# Altium schematic sheet RelayOutputs.SchDoc
size A4
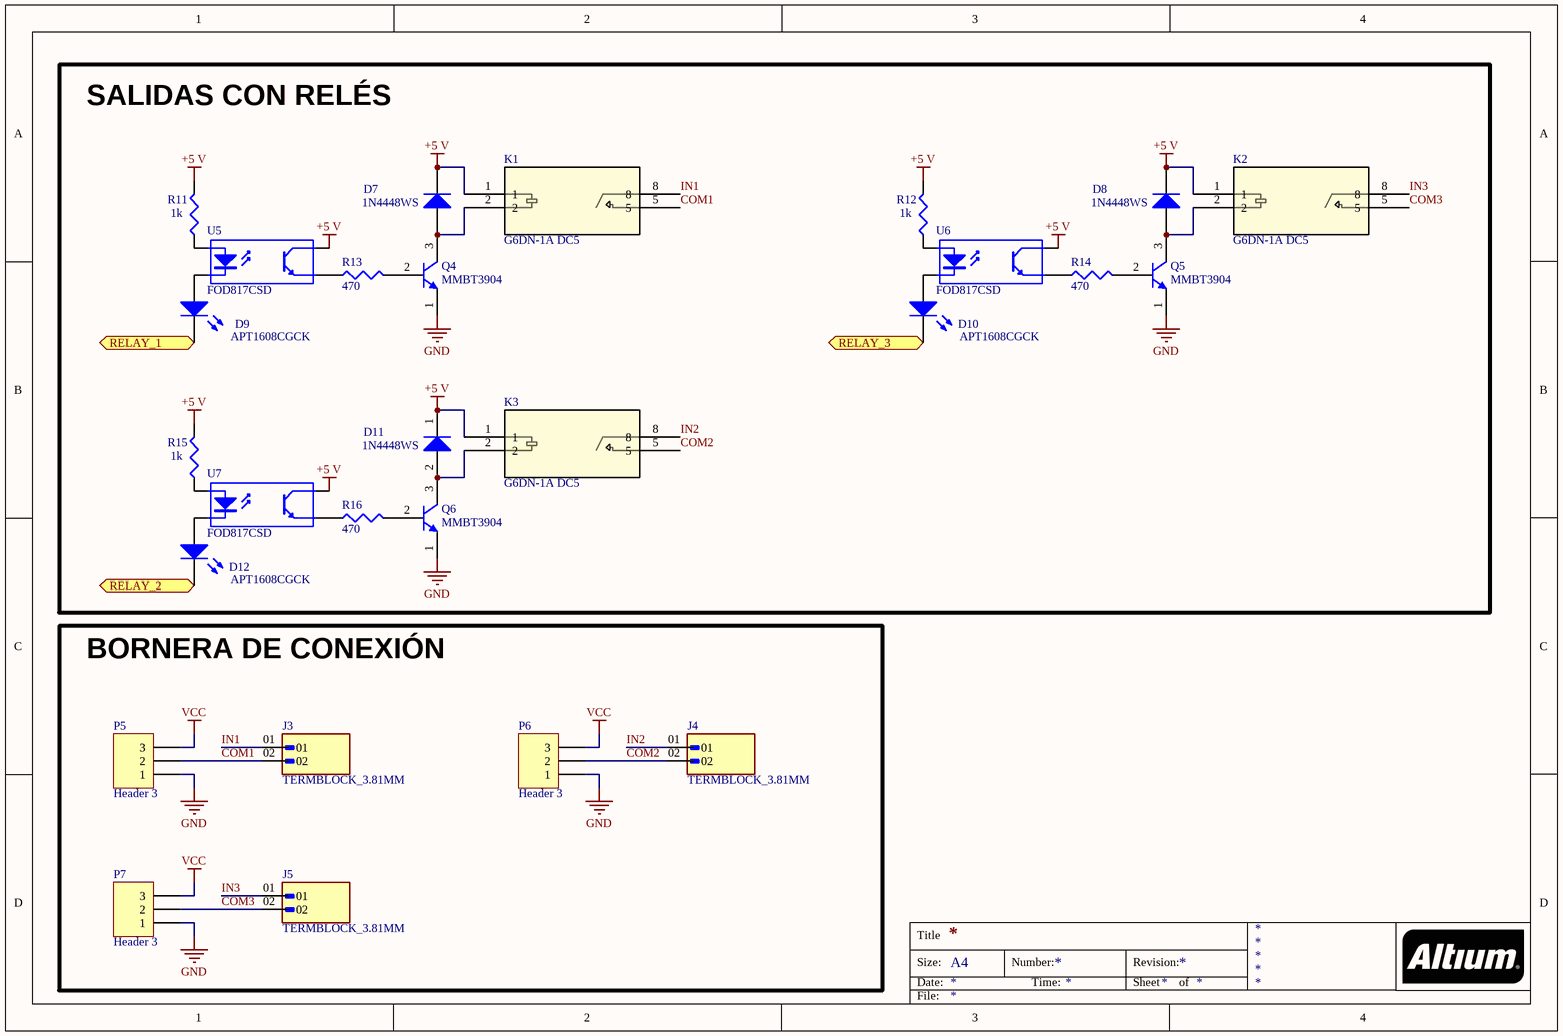
[diagram p0: RelayOutputs.SchDoc]

## Parts
D7  1N4448WS  [SOD-323]
D8  1N4448WS  [SOD-323]
D9  APT1608CGCK  [ChipDiode1608]
D10  APT1608CGCK  [ChipDiode1608]
D11  1N4448WS  [SOD-323]
D12  APT1608CGCK  [ChipDiode1608]
J3  TERMBLOCK_3.81MM  [TERMBLOCK_3.81MM_90DEG_2POS]
J4  TERMBLOCK_3.81MM  [TERMBLOCK_3.81MM_90DEG_2POS]
J5  TERMBLOCK_3.81MM  [TERMBLOCK_3.81MM_90DEG_2POS]
K1  G6DN-1A DC5  [RELAY_G6DN-1A_OMR]
K2  G6DN-1A DC5  [RELAY_G6DN-1A_OMR]
K3  G6DN-1A DC5  [RELAY_G6DN-1A_OMR]
P5  Header 3  [CONNHDR_1X3_2.54MM]
P6  Header 3  [CONNHDR_1X3_2.54MM]
P7  Header 3  [CONNHDR_1X3_2.54MM]
Q4  MMBT3904  [MMBT3904]
Q5  MMBT3904  [MMBT3904]
Q6  MMBT3904  [MMBT3904]
R11  1k  [RESC2012N]
R12  1k  [RESC2012N]
R13  470  [RESC2012N]
R14  470  [RESC2012N]
R15  1k  [RESC2012N]
R16  470  [RESC2012N]
U5  FOD817CSD  [OPTOISOLATOR 5KV TRANSISTOR 4SMD]
U6  FOD817CSD  [OPTOISOLATOR 5KV TRANSISTOR 4SMD]
U7  FOD817CSD  [OPTOISOLATOR 5KV TRANSISTOR 4SMD]

## Blocks framed on the sheet
SALIDAS CON RELÉS: D7-D12 K1-K3 Q4-Q6 R11-R16 U5-U7
BORNERA DE CONEXIÓN: J3-J5 P5-P7

## Ports
RELAY_1 (bidir), RELAY_2 (bidir), RELAY_3 (bidir)

## Nets
+5 V: D7.1(K) D8.1(K) D11.1(K) K1.1 K2.1 K3.1 R11.2 R12.2 R15.2 U5.4(C) U6.4(C) U7.4(C)
GND: P5.1 P6.1 P7.1 Q4.1(E) Q5.1(E) Q6.1(E)
VCC: P5.3 P6.3 P7.3
COM1: J3.02 K1.5 P5.2
COM2: J4.02 K3.5 P6.2
COM3: J5.02 K2.5 P7.2
IN1: J3.01 K1.8
IN2: J4.01 K3.8
IN3: J5.01 K2.8
RELAY_1: D9.2(K) ; port RELAY_1
RELAY_2: D12.2(K) ; port RELAY_2
RELAY_3: D10.2(K) ; port RELAY_3
NetD7_2: D7.2(A) K1.2 Q4.3(C)
NetD8_2: D8.2(A) K2.2 Q5.3(C)
NetD9_1: D9.1(A) U5.2(K)
NetD10_1: D10.1(A) U6.2(K)
NetD11_2: D11.2(A) K3.2 Q6.3(C)
NetD12_1: D12.1(A) U7.2(K)
NetQ4_2: Q4.2(B) R13.2
NetQ5_2: Q5.2(B) R14.2
NetQ6_2: Q6.2(B) R16.2
NetR11_1: R11.1 U5.1(A)
NetR12_1: R12.1 U6.1(A)
NetR13_1: R13.1 U5.3(E)
NetR14_1: R14.1 U6.3(E)
NetR15_1: R15.1 U7.1(A)
NetR16_1: R16.1 U7.3(E)

## Notes on the sheet
- Title
- Size:
- Date:
- A4
- Number:
- Time:
- Revision:
- Sheet
- of
- File:

## Library data of the parts
D7 D8 D11 = Diode: Default Diode; Published: 8-Jun-2000; LatestRevisionDate: 17-Jul-2002; LatestRevisionNote: Re-released for DXP Platform.; PackageVersion: Sep-1996; PackageReference: SMC; Publisher: Altium Limited; PackageDescription: DO-214-AB/SMC; 2 C-Bend Leads; Body 7.9 x 5.9 mm, inc. leads (LxW); Code_JEDEC: DO-214-AB
D9 D10 D12 = LED2: LED 1.6x0.8 mm 570 nm GRN CLR SMD; Published: 8-Jun-2000; LatestRevisionDate: 17-Jul-2002; LatestRevisionNote: Re-released for DXP Platform.; PackageVersion: Feb-2002; PackageReference: 3.2X1.6X1.1; Publisher: Altium Limited; PackageDescription: SM LED; 2 Flat Leads
J3-J5 = TERMBLOCK_3.81MM_90DEG_2POS: TERMBLOCK_3.81MM_90DEG_2POS (DigiKey: 1803277)
K1-K3 = G6DN-1A DC5: Rele_Omron_5V_5A; Mfr_Name: Omron; RefDes: RefDes; Type: Type
P5-P7 = Header 3: Header, 3-Pin; LatestRevisionDate: 17-Jul-2002; LatestRevisionNote: Re-released for DXP Platform.; Publisher: Altium Limited
Q4-Q6 = MMBT3904: TRANS NPN 40V 0.2A SOT-23-3
R11 R12 R15 = Res3: Resistor; Published: 8-Jun-2000; LatestRevisionDate: 29-May-2009; LatestRevisionNote: IPC-7351 Footprint Added.; PackageReference: J1-0603; Publisher: Altium Limited; PackageDescription: Chip Resistor; Value: 1k
R13 R14 R16 = Res3: Resistor; Value: 510; Published: 8-Jun-2000; LatestRevisionDate: 29-May-2009; LatestRevisionNote: IPC-7351 Footprint Added.; PackageReference: J1-0603; Publisher: Altium Limited; PackageDescription: Chip Resistor
U5-U7 = Optoisolator1: 4-Pin Phototransistor Optocoupler; Published: 24-Mar-1999; LatestRevisionDate: 04-Mar-2005; LatestRevisionNote: Sch pins 3 & 4 Swapped.; DatasheetVersion: Nov-2003; PackageReference: DIP-4; Publisher: Altium Limited